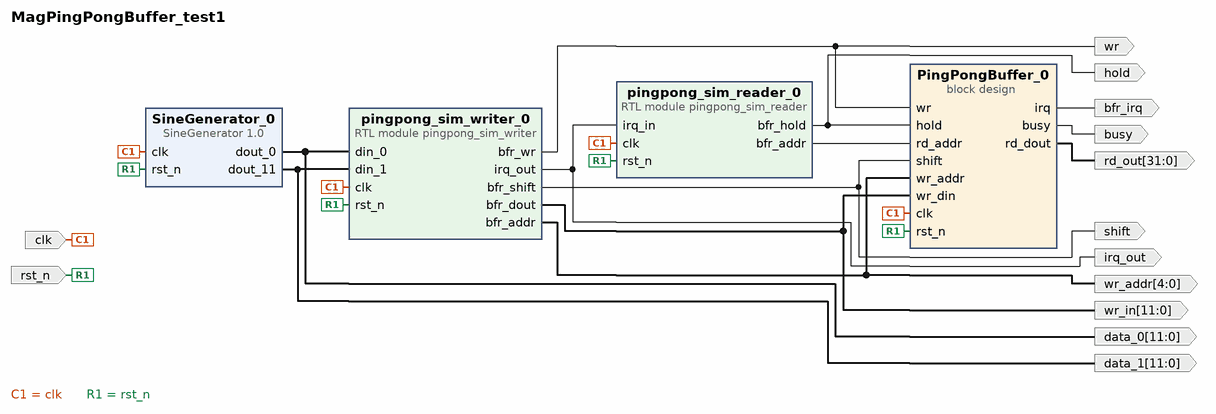
[diagram p0: block diagram of the top level]
# Vivado block design MagPingPongBuffer_test1, xczu3eg-sbva484-1-i, Vivado 2020.2
create_bd_design MagPingPongBuffer_test1

create_bd_port -dir I -type clk clk
create_bd_port -dir I -type rst rst_n
create_bd_port -dir O hold
create_bd_port -dir O busy
create_bd_port -dir O bfr_irq
create_bd_port -dir O -from 31 -to 0 rd_out
create_bd_port -dir O shift
create_bd_port -dir O wr
create_bd_port -dir O -from 4 -to 0 wr_addr
create_bd_port -dir O -from 11 -to 0 wr_in
create_bd_port -dir O -from 11 -to 0 data_1
create_bd_port -dir O irq_out
create_bd_port -dir O -from 11 -to 0 data_0

create_bd_cell -type ip -vlnv DIII:PL-Mag-Sensor:SineGenerator:1.0 SineGenerator_0
create_bd_cell -type module -reference pingpong_sim_reader pingpong_sim_reader_0
set_property -dict {CONFIG.addr_width 5 CONFIG.word_width 32} [get_bd_cells pingpong_sim_reader_0]
create_bd_cell -type container -reference PingPongBuffer PingPongBuffer_0
set_property -dict [list \
  CONFIG.ACTIVE_SIM_BD PingPongBuffer.bd \
  CONFIG.ACTIVE_SYNTH_BD PingPongBuffer.bd \
  CONFIG.ENABLE_DFX 0 \
  CONFIG.LIST_SIM_BD PingPongBuffer.bd \
  CONFIG.LIST_SYNTH_BD PingPongBuffer.bd \
  CONFIG.LOCK_PROPAGATE 0 \
  CONFIG.TRAINING_MODULE PingPongBuffer.bd \
] [get_bd_cells PingPongBuffer_0]
create_bd_cell -type module -reference pingpong_sim_writer pingpong_sim_writer_0

# ---- connections ----

connect_bd_net -net clk_0_1 [get_bd_ports clk] \
  [get_bd_pins SineGenerator_0/clk] [get_bd_pins pingpong_sim_reader_0/clk] [get_bd_pins PingPongBuffer_0/clk] \
  [get_bd_pins pingpong_sim_writer_0/clk]
connect_bd_net -net rst_n_0_1 [get_bd_ports rst_n] \
  [get_bd_pins SineGenerator_0/rst_n] [get_bd_pins pingpong_sim_reader_0/rst_n] [get_bd_pins PingPongBuffer_0/rst_n] \
  [get_bd_pins pingpong_sim_writer_0/rst_n]
connect_bd_net [get_bd_pins pingpong_sim_reader_0/bfr_hold] [get_bd_ports hold] [get_bd_pins PingPongBuffer_0/hold]
connect_bd_net [get_bd_pins pingpong_sim_writer_0/bfr_wr] [get_bd_ports wr] [get_bd_pins PingPongBuffer_0/wr]
connect_bd_net [get_bd_pins pingpong_sim_writer_0/bfr_shift] [get_bd_ports shift] [get_bd_pins PingPongBuffer_0/shift]
connect_bd_net [get_bd_pins pingpong_sim_writer_0/bfr_dout] [get_bd_ports wr_in] [get_bd_pins PingPongBuffer_0/wr_din]
connect_bd_net [get_bd_pins pingpong_sim_writer_0/bfr_addr] [get_bd_ports wr_addr] [get_bd_pins PingPongBuffer_0/wr_addr]
connect_bd_net [get_bd_pins pingpong_sim_writer_0/irq_out] [get_bd_ports irq_out] [get_bd_pins pingpong_sim_reader_0/irq_in]
connect_bd_net [get_bd_pins SineGenerator_0/dout_0] [get_bd_ports data_0] [get_bd_pins pingpong_sim_writer_0/din_0]
connect_bd_net [get_bd_pins SineGenerator_0/dout_11] [get_bd_ports data_1] [get_bd_pins pingpong_sim_writer_0/din_1]
connect_bd_net [get_bd_pins pingpong_sim_reader_0/bfr_addr] [get_bd_pins PingPongBuffer_0/rd_addr]
connect_bd_net [get_bd_pins PingPongBuffer_0/busy] [get_bd_ports busy]
connect_bd_net [get_bd_pins PingPongBuffer_0/irq] [get_bd_ports bfr_irq]
connect_bd_net [get_bd_pins PingPongBuffer_0/rd_dout] [get_bd_ports rd_out]

validate_bd_design
save_bd_design
